# EAGLE design control (EAGLE 9.0.1)
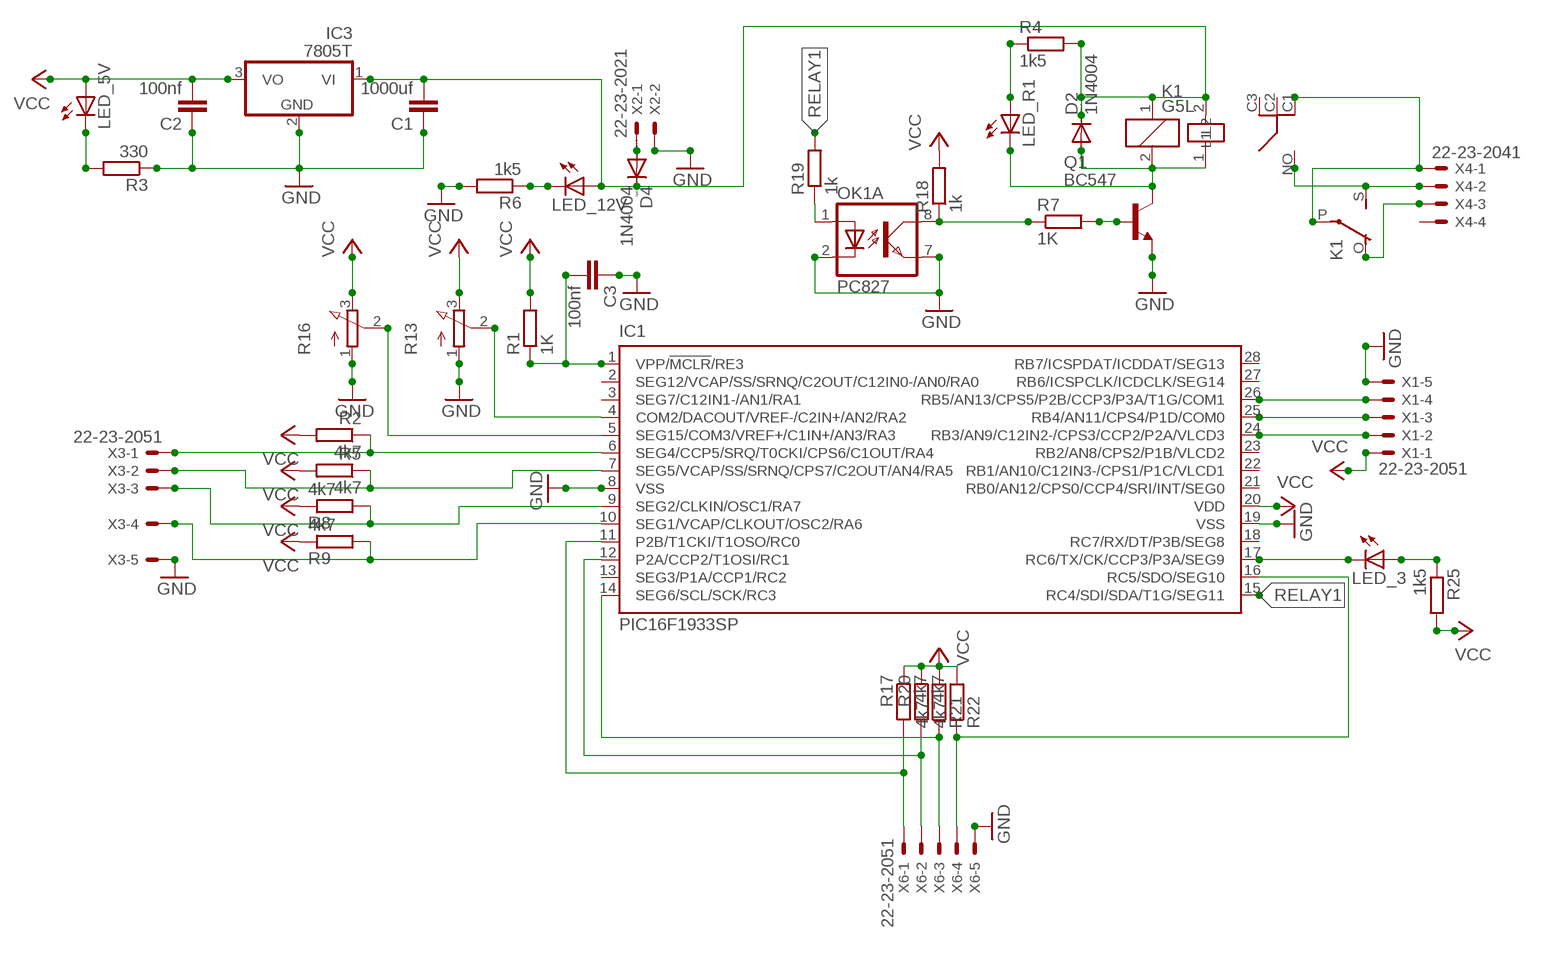
[diagram p0: schematic, sheet 1]

## Parts
C1  1000uf  C5/2.5  [C5B2.5]
C2  100nf  C2.5/6  [C2.5-6]
C3  100nf  C2.5/6  [C2.5-6]
D2  1N4004  [DO41-10]
D4  1N4004  [DO41-10]
IC1  PIC16F1933SP  [DIL28-3]
IC3  7805T  [TO220H]
K1  G5L  [G5LE]
LED_3  LED3MM  [LED3MM]
LED_5V  LED3MM  [LED3MM]
LED_12V  LED3MM  [LED3MM]
LED_R1  LED3MM  [LED3MM]
OK1  PC827  [DIL08]
Q1  BC547  BC548  [TO92-EBC]
R1  1K  R-EU_0207/10  [0207/10]
R2  4k7  R-EU_0207/10  [0207/10]
R3  330  R-EU_0207/10  [0207/10]
R4  1k5  R-EU_0207/10  [0207/10]
R5  4k7  R-EU_0207/10  [0207/10]
R6  1k5  R-EU_0207/10  [0207/10]
R7  1K  R-EU_0207/10  [0207/10]
R8  4k7  R-EU_0207/10  [0207/10]
R9  4k7  R-EU_0207/10  [0207/10]
R13  3RP/1610N  [3RP/1610N]
R16  3RP/1610N  [3RP/1610N]
R17  4k7  R-EU_0207/10  [0207/10]
R18  1k  R-EU_0207/10  [0207/10]
R19  1k  R-EU_0207/10  [0207/10]
R20  4k7  R-EU_0207/10  [0207/10]
R21  4k7  R-EU_0207/10  [0207/10]
R22  4k7  R-EU_0207/10  [0207/10]
R25  1k5  R-EU_0207/10  [0207/10]
U$1  RL703  [RL703]
X1  22-23-2051  [22-23-2051]
X2  22-23-2021  [22-23-2021]
X3  22-23-2051  [22-23-2051]
X4  22-23-2041  [22-23-2041]
X6  22-23-2051  [22-23-2051]

## Nets
GND: C1.1 C2.1 C3.1 IC1.8(VSS) IC1.19(VSS) IC3.2(GND) OK1.2(A:C) OK1.7(A:EMIT) Q1.E R3.1 R6.2 R13.1(A) R16.1(A) X1.5 X2.2 X3.5 X6.5
N$1: IC1.7(SEG5/VCAP/SS/SRNQ/CPS7/C2OUT/AN4/RA5) R5.1 X3.2
N$2: C3.2 IC1.1(VPP/!MCLR!/RE3) R1.1
N$3: IC1.4(COM2/DACOUT/VREF-/C2IN+/AN2/RA2) R13.2(S)
N$4: IC1.5(SEG15/COM3/VREF+/C1IN+/AN3/RA3) R16.2(S)
N$5: IC1.25(RB4/AN11/CPS4/P1D/COM0) X1.3
N$6: IC1.6(SEG4/CCP5/SRQ/T0CKI/CPS6/C1OUT/RA4) R2.1 X3.1
N$7: IC1.9(SEG2/CLKIN/OSC1/RA7) R8.2 X3.3
N$8: IC1.10(SEG1/VCAP/CLKOUT/OSC2/RA6) R9.2 X3.4
N$9: IC1.14(SEG6/SCL/SCK/RC3) R21.1 X6.3
N$10: Q1.B R7.2
N$11: D2.A K1.2 LED_R1.K(C) Q1.C U$1.1(L2)
N$13: IC1.11(P2B/T1CKI/T1OSO/RC0) R17.2 X6.1
N$14: IC1.24(RB3/AN9/C12IN2-/CPS3/CCP2/P2A/VLCD3) X1.2
N$15: IC1.12(P2A/CCP2/T1OSI/RC1) R20.2 X6.2
N$18: K1.S(2:S) U$1.NO X4.2
N$19: K1.P(2:P) U$1.C1 X4.1
N$20: K1.O(2:O) X4.3
N$21: D4.A X2.1
N$22: LED_5V.K(C) R3.2
N$24: IC1.26(RB5/AN13/CPS5/P2B/CCP3/P3A/T1G/COM1) X1.4
N$26: LED_R1.A R4.1
N$30: LED_12V.K(C) R6.1
N$37: C1.2 D2.C D4.C IC3.1(VI) K1.1 LED_12V.A R4.2 U$1.2(L1)
N$38: OK1.8(A:COL) R7.1 R18.1
N$41: OK1.1(A:A) R19.1
N$42: IC1.16(RC5/SDO/SEG10) R22.1 X6.4
N$46: LED_3.A R25.1
N$47: IC1.17(RC6/TX/CK/CCP3/P3A/SEG9) LED_3.K(C)
RELAY1: IC1.15(RC4/SDI/SDA/T1G/SEG11) R19.2
VCC: C2.2 IC1.20(VDD) IC3.3(VO) LED_5V.A R1.2 R2.2 R5.2 R8.1 R9.1 R13.3(E) R16.3(E) R17.1 R18.2 R20.1 R21.2 R22.2 R25.2 X1.1
Unconnected: IC1.2(SEG12/VCAP/SS/SRNQ/C2OUT/C12IN0-/AN0/RA0) IC1.3(SEG7/C12IN1-/AN1/RA1) IC1.13(SEG3/P1A/CCP1/RC2) IC1.18(RC7/RX/DT/P3B/SEG8) IC1.21(RB0/AN12/CPS0/CCP4/SRI/INT/SEG0) IC1.22(RB1/AN10/C12IN3-/CPS1/P1C/VLCD1) IC1.23(RB2/AN8/CPS2/P1B/VLCD2) IC1.27(RB6/ICSPCLK/ICDCLK/SEG14) IC1.28(RB7/ICSPDAT/ICDDAT/SEG13) OK1.3(B:A) OK1.4(B:C) OK1.5(B:EMIT) OK1.6(B:COL) U$1.C2 U$1.C3 X4.4

## Library data of the parts
C1-C3 = capacitor-wima:C: CAPACITOR naming: grid - package width
D2 D4 = diode:1N4004: DIODE general purpose rectifier, 1 A
IC1 = microchip:PIC16F19*: Flash-Based, 8-Bit CMOS Microcontrollers wtih LCD Driver and nanoWatt XLP Technology Auto generated by make-symbol-device-package-bsdl.ulp Rev. 33 Source: http://ww1.microchip.com/downloads/en/DeviceDoc/41364D.pdf; MPN: PIC16F1933-I/SP; OC_FARNELL: 1755814; OC_NEWARK: 08R1938
IC3 = linear:78*: Positive VOLTAGE REGULATOR Source: http://cache.national.com/ds/LM/LM78L05.pdf http://www.fairchildsemi.com/ds/LM/LM7805.pdf
K1 = relay:G5L: RELAY 1 x switch, 10 A/120 V AC, 8 A/30 V ADC, Omron; OC_FARNELL: unknown; OC_NEWARK: unknown
LED_3 LED_5V LED_12V LED_R1 = led:LED: LED OSRAM: - CHIPLED LG R971, LG N971, LY N971, LG Q971, LY Q971, LO R971, LY R971 LH N974, LH R974 LS Q976, LO Q976, LY Q976 LO Q996 - Hyper CHIPLED LW Q18S LB Q993, LB Q99A, LB R99A - SideLED LS A670, LO A670, LY A670, LG A670, LP A670 LB A673, LV A673, LT A673, LW A673 LH A674 LY A675 LS A676, LA A676, LO A676, LY A676, LW A676 LS A679, LY A679, LG A679 - Hyper Micro SIDELED® LS Y876, LA Y876, LO Y876, LY Y876 LT Y87S - SmartLED LW L88C, LW L88S LB L89C, LB L89S, LG L890 LS L89K, LO L89K, LY L89K LS L896, LA L896, LO L896, LY L896 - TOPLED LS T670, LO T670, LY T670, LG T670, LP T670 LSG T670, LSP T670, LSY T670, LOP T670, LYG T670 LG T671, LOG T671, LSG T671 LB T673, LV T673, LT T673, LW T673 LH T674 LS T676, LA T676, LO T676, LY T676, LB T676, LH T676, LSB T676, LW T676 LB T67C, LV T67C, LT T67C, LS T67K, LO T67K, LY T67K, LW E67C LS E67B, LA E67B, LO E67B, LY E67B, LB E67C, LV E67C, LT E67C LW T67C LS T679, LY T679, LG T679 LS T770, LO T770, LY T770, LG T770, LP T770 LB T773, LV T773, LT T773, LW T773 LH T774 LS E675, LA E675, LY E675, LS T675 LS T776, LA T776, LO T776, LY T776, LB T776 LHGB T686 LT T68C, LB T68C - Hyper Mini TOPLED® LB M676 - Mini TOPLED Santana® LG M470 LS M47K, LO M47K, LY M47K Source: http://www.osram.convergy.de LUXEON: - LUMILED® LXK2-PW12-R00, LXK2-PW12-S00, LXK2-PW14-U00, LXK2-PW14-V00 LXK2-PM12-R00, LXK2-PM12-S00, LXK2-PM14-U00 LXK2-PE12-Q00, LXK2-PE12-R00, LXK2-PE12-S00, LXK2-PE14-T00, LXK2-PE14-U00 LXK2-PB12-K00, LXK2-PB12-L00, LXK2-PB12-M00, LXK2-PB14-N00, LXK2-PB14-P00, LXK2-PB14-Q00 LXK2-PR12-L00, LXK2-PR12-M00, LXK2-PR14-Q00, LXK2-PR14-R00 LXK2-PD12-Q00, LXK2-PD12-R00, LXK2-PD12-S00 LXK2-PH12-R00, LXK2-PH12-S00 LXK2-PL12-P00, LXK2-PL12-Q00, LXK2-PL12-R00 Source: www.luxeon.com KINGBRIGHT: KA-3528ASYC Source: www.kingbright.com
OK1 = optocoupler:PC827: SHARP OPTO COUPLER; OC_FARNELL: unknown; OC_NEWARK: unknown
Q1 = transistor-npn:BC548*: NPN Transistor
R1-R9 R17-R22 R25 = resistor:R-EU_: RESISTOR, European symbol
R13 R16 = pot:3RP/1610N: 16mm Potentiometer one level Source: http://www.alphapotentiometers.net/html/16mm_pot_2.html
U$1 = relay:RL703
X1 X3 X6 = con-molex:22-23-2051: .100" (2.54mm) Center Header - 5 Pin; MF: MOLEX; MPN: 22-23-2051; OC_FARNELL: 1462952; OC_NEWARK: 38C9178
X2 = con-molex:22-23-2021: .100" (2.54mm) Center Header - 2 Pin; MF: MOLEX; MPN: 22-23-2021; OC_FARNELL: 1462926; OC_NEWARK: 25C3832
X4 = con-molex:22-23-2041: .100" (2.54mm) Center Header - 4 Pin; MF: MOLEX; MPN: 22-23-2041; OC_FARNELL: 1462920; OC_NEWARK: 38C0355

## Board
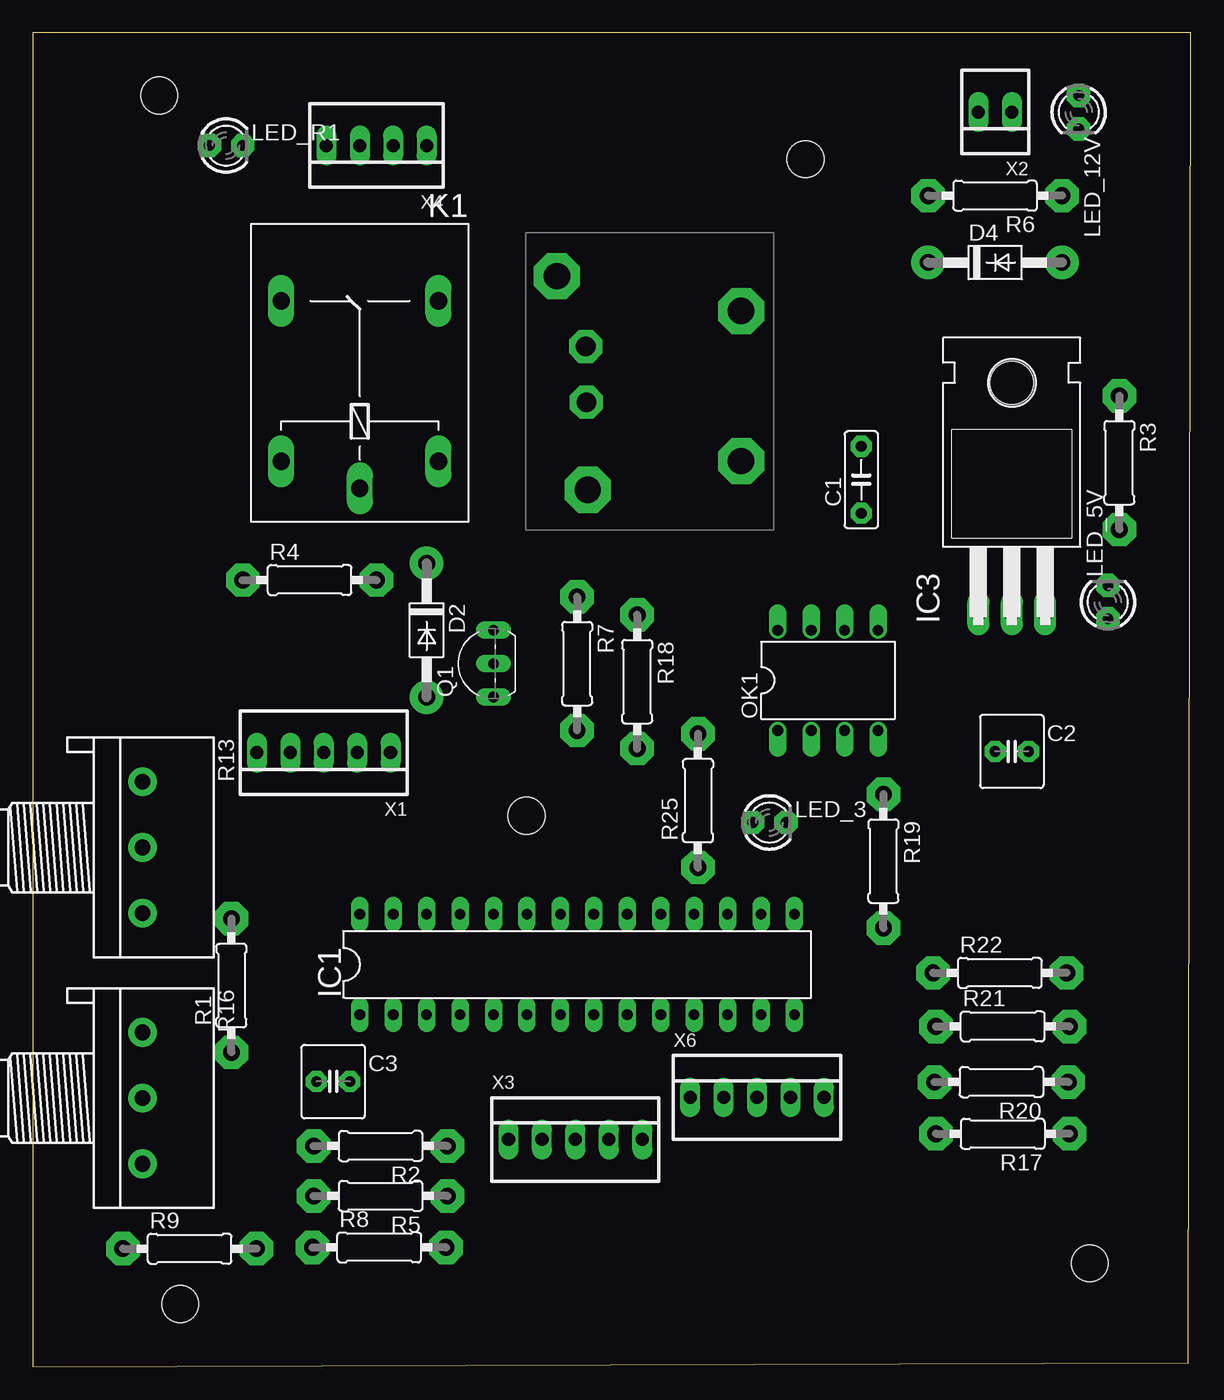
[diagram p1: board, top side]
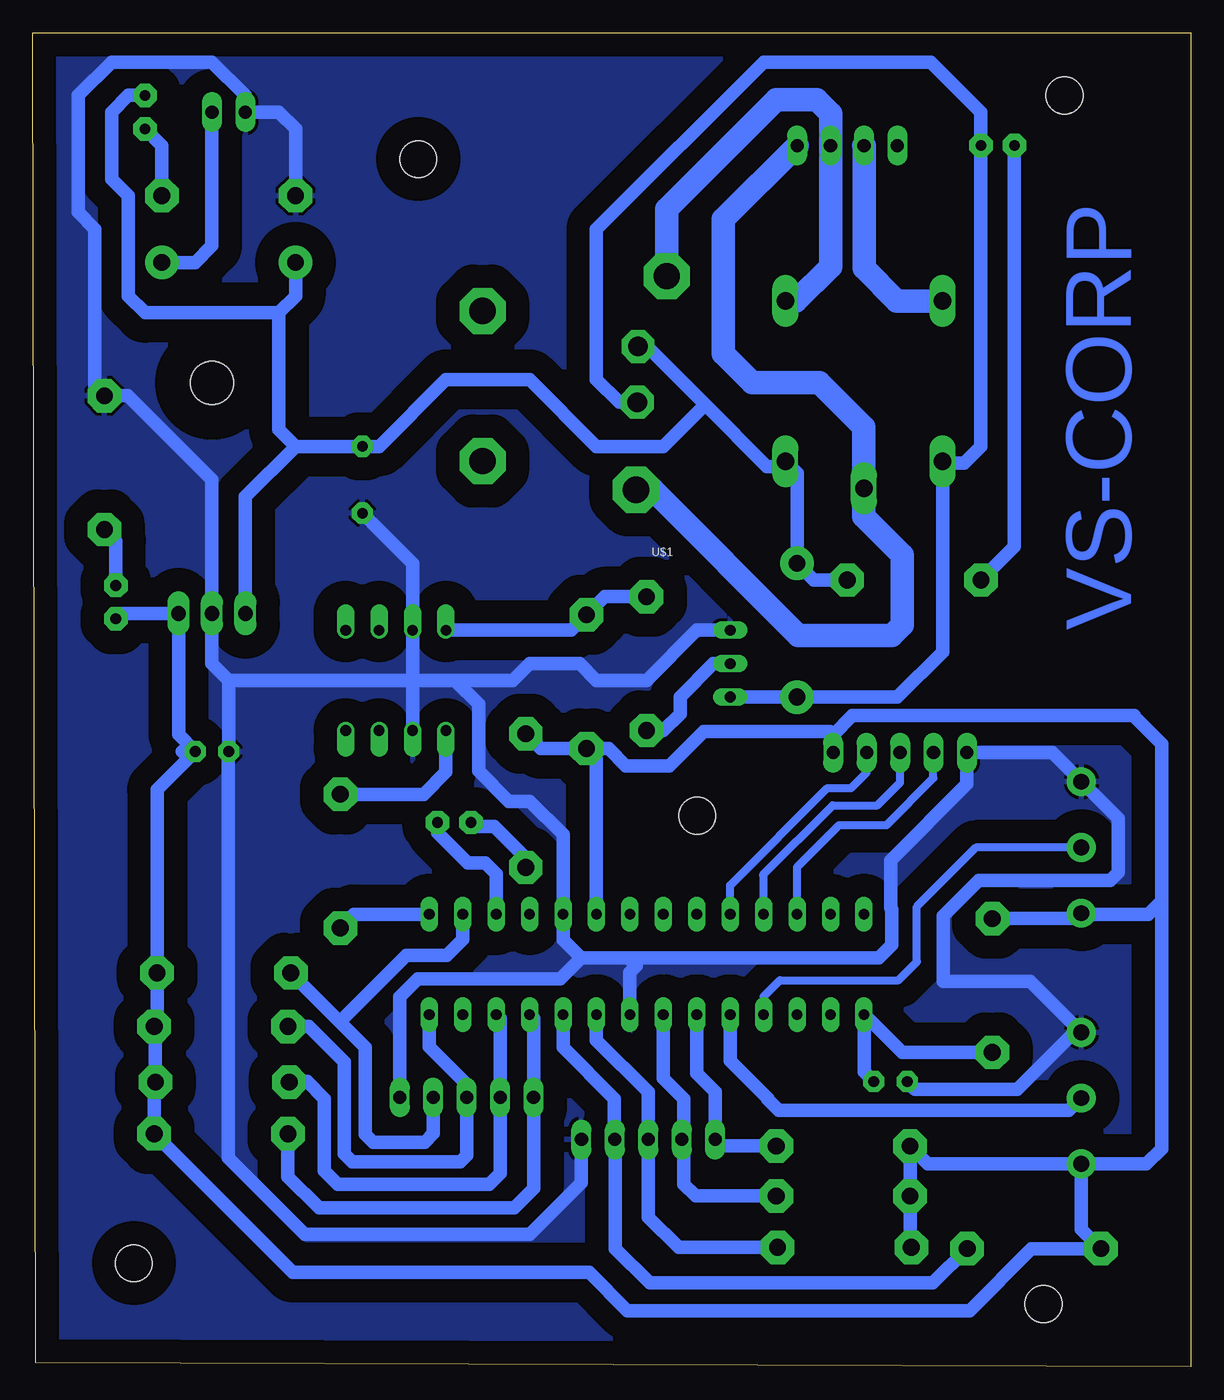
[diagram p2: board, bottom side, seen from below]

Size 87.96 x 101.35 mm. Coordinates in mm from the lower left corner, seen from the top.
Outline: 0,0 87.76,0.3 87.96,101.35 0,101.35 0,0
Copper layers (1*16): Top 0.035mm / dielectric 1.5mm / Bottom 0.035mm
Design rules "default": minimum track width 10mil, minimum drill 24mil, track to track 8mil, track to pad 8mil, pad to pad 8mil, via to via 8mil, smd to smd 8mil, copper to edge 40mil, drill to drill 8mil, minimum pad ring 10mil, minimum via ring 8mil, stop-mask expansion 4mil, vias tented up to drill 0mil, thermal gap 10mil
Holes 2.8 mm at 80.29,7.86 9.59,96.6 11.19,4.76 37.49,41.86 58.69,91.76

### Footprints (pad centres in the part's own frame; a part is rotated, then mirrored left to right if it is on the bottom)
C5B2.5 = drill 0.813 pad 1.6 octagon: 1 -2.54,0; 2 2.54,0
C2.5-6 = drill 0.813 pad 1.6 octagon: 1 -1.27,0; 2 1.27,0
DO41-10 = drill 1.27 pad 2.54: A 5.08,0; C -5.08,0
DIL28-3 = drill 0.813 long: 1 -16.51,-3.81; 2 -13.97,-3.81; 3 -11.43,-3.81; 4 -8.89,-3.81; 5 -6.35,-3.81; 6 -3.81,-3.81; 7 -1.27,-3.81; 8 1.27,-3.81; 9 3.81,-3.81; 10 6.35,-3.81; 11 8.89,-3.81; 12 11.43,-3.81; 13 13.97,-3.81; 14 16.51,-3.81; 15 16.51,3.81; 16 13.97,3.81; 17 11.43,3.81; 18 8.89,3.81; 19 6.35,3.81; 20 3.81,3.81; 21 1.27,3.81; 22 -1.27,3.81; 23 -3.81,3.81; 24 -6.35,3.81; 25 -8.89,3.81; 26 -11.43,3.81; 27 -13.97,3.81; 28 -16.51,3.81
TO220H = drill 1.118 long: 1 -2.54,-10.16; 2 0,-10.16; 3 2.54,-10.16 | hole 3.302: 0,7.366
G5LE = drill 1.321 long: 1 -7.493,-5.969; 2 -7.493,5.969; O 4.699,5.969; P -9.525,0; S 4.699,-5.969
LED3MM = drill 0.813 pad 1.778 octagon: A -1.27,0; K 1.27,0
DIL08 = drill 0.813 offset: 1 -3.81,-3.81; 2 -1.27,-3.81; 3 1.27,-3.81; 4 3.81,-3.81; 5 3.81,3.81; 6 1.27,3.81; 7 -1.27,3.81; 8 -3.81,3.81
TO92-EBC = drill 0.813 long: B 0,-1.27; C -2.54,-1.27; E 2.54,-1.27
0207/10 = drill 1.27 pad 2.54 octagon: 1 -5.08,0; 2 5.08,0
3RP/1610N = drill 1.2 pad 2.184: 1 -5,0; 2 0,0; 3 5,0
RL703 = drill 1.5 pad 2.5 octagon: 1 1.73,-5.643; 2 -2.51,-5.693 | drill 2 pad 3.5 octagon: C1 8.38,-5.543; C2 6.2,6.107; C3 -5.21,6.107; NO -7.86,-7.883
22-23-2051 = drill 1 long: 1 -5.08,0; 2 -2.54,0; 3 0,0; 4 2.54,0; 5 5.08,0
22-23-2021 = drill 1 long: 1 -1.27,0; 2 1.27,0
22-23-2041 = drill 1 long: 1 -3.81,0; 2 -1.27,0; 3 1.27,0; 4 3.81,0

### Placement (x,y rotation side)
C1  62.93,67.39 90 top
C2  74.36,46.75 0 top
C3  22.81,21.66 0 top
D2  29.91,55.96 270 top
D4  73.09,83.9 0 top
IC1  41.34,30.56 0 top
IC3  74.36,67.39 0 top
K1  24.83,76.28 90 top
LED_3  55.95,41.35 0 top
LED_5V  81.66,58.09 90 top
LED_12V  79.44,95.33 270 top
LED_R1  14.67,92.79 0 top
OK1  60.39,52.15 0 top
Q1  33.72,53.42 90 top
R1  15.08,28.96 90 top
R2  26.41,16.76 180 top
R3  82.53,68.69 270 top
R4  21.02,59.77 0 top
R5  26.41,12.96 180 top
R6  73.09,88.98 180 top
R7  41.34,53.42 270 top
R8  26.31,9.06 0 top
R9  11.91,8.96 0 top
R13  8.32,39.45 270 top
R16  8.32,20.4 270 top
R17  73.67,17.69 180 top
R18  45.9,52.05 270 top
R19  64.61,38.41 270 top
R20  73.57,21.62 180 top
R21  73.67,25.85 0 top
R22  73.45,29.92 0 top
R25  50.52,43.01 90 top
U$1  47.69,75.01 270 top
X1  22.09,46.66 180 top
X2  73.09,95.33 180 top
X3  41.21,17.26 0 top
X4  26.1,92.79 180 top
X6  55.01,20.46 0 top

### Tracks (layer width: path | path; a pad name or v marks a point on that pad's centre or on a via)
GND
  Bottom 1.016: R6.2 68.01,94.06 69.28,95.33 X2.2 71.82,96.6 74.36,99.14 81.98,99.14 84.52,96.6 84.52,87.71 83.25,86.44 83.25,74.49 R3.1 80.74,73.77 74.36,67.39 IC3.2 74.36,53.42 73.09,52.15 | 59.12,52.15 OK1.7 59.12,61.04 C1.1 | 59.12,52.15 OK1.2 | 55.91,52.15 51.5,52.15 50.23,53.42 46.42,53.42 45.15,52.15 41.34,52.15 37.53,55.96 Q1.E | 55.91,52.15 59.12,52.15 | 59.12,52.15 73.09,52.15 | 42.61,31.06 23.71,31.06 22.71,32.06 22.71,34.76 22.81,34.86 22.81,38.46 17.01,44.26 X1.5 10.53,46.66 R13.1 5.51,41.64 5.51,37.56 6.11,36.96 16.11,36.96 18.81,34.26 18.81,29.26 12.18,29.26 R16.1 8.58,25.66 13.18,21.06 20.94,21.06 C3.1 21.04,21.16 | 42.61,31.06 46.31,31.06 | 46.31,31.06 47.69,32.44 IC1.19 47.69,40.44 50.21,42.96 51.81,42.96 54.11,45.26 54.11,50.35 55.91,52.15 | 73.09,52.15 C2.1 73.11,46.73 73.11,15.86 67.31,10.06 50.21,10.06 46.29,13.98 X3.5 | IC1.8 42.61,29.96 42.11,30.46 42.61,30.96 42.61,31.06 | X6.5 60.09,28.08 58.71,29.46 47.91,29.46 46.31,31.06
  pour Bottom (isolate 1.778): -0.07,101.98 87.95,101.48 87.75,0.1 -0.27,0.6
N$1
  Bottom 1.016: IC1.7 40.07,21.92 38.51,20.36 38.51,17.42 | 38.51,17.42 X3.2 | R5.1 37.61,12.96 38.51,13.86 38.51,17.42
N$2
  Bottom 1.016: IC1.1 | C3.2 24.82,22.4 IC1.1 | R1.1 21.94,23.88 IC1.1
N$3
  Bottom 0.61: IC1.4 32.45,28.12 31.21,29.36 22.21,29.36 20.81,30.76 20.81,34.96 16.32,39.45 R13.2 8.32,39.05
N$4
  Bottom 1.016: IC1.5 34.99,23.24 32.15,20.4 32.15,20.3 31.31,19.46 9.26,19.46 R16.2
N$5
  Bottom 0.61: IC1.25 32.45,37.3 32.51,37.36 27.21,42.66 23.81,42.66 22.09,44.38 X1.3
N$6
  Bottom 1.016: IC1.6 37.53,22.28 36.13,20.88 X3.1 35.63,16.76 R2.1
N$7
  Bottom 1.016: IC1.9 45.15,24.8 41.21,20.86 X3.3 41.21,11.36 38.91,9.06 R8.2
N$8
  Bottom 1.016: IC1.10 47.69,24.24 43.81,20.36 43.81,17.32 | 43.81,17.32 X3.4 | 43.81,17.32 43.93,17.2 43.71,16.98 43.71,8.96 41.11,6.36 19.59,6.36 R9.2
N$9
  Bottom 1.016: IC1.14 57.85,24.3 55.01,21.46 X6.3 55.01,16.06 55.51,15.56 63.71,15.56 64.31,16.16 64.31,23.16 67,25.85 R21.1
N$10
  Bottom 1.016: Q1.B 36.26,53.42 38.8,50.88 38.8,49.61 40.07,48.34 R7.2
N$11
  Bottom 1.016: U$1.1 43.42,73.28 45.15,75.01 45.15,86.44 32.45,99.14 19.75,99.14 15.94,95.33 LED_R1.K 15.94,69.93 17.21,68.66 18.73,68.66 K1.2 18.86,54.31 22.29,50.88 D2.A Q1.C
N$13
  Bottom 1.016: IC1.11 49.93,26.45 X6.1 49.93,13.54 51.41,12.06 66.21,12.06 68.59,14.44 R17.2
N$14
  Bottom 0.61: IC1.24 34.99,36.58 27.61,43.96 25.81,43.96 24.63,45.14 X1.2
N$15
  Bottom 1.016: R20.2 67.15,21.62 67.11,21.66 65.81,20.36 65.81,14.86 64.81,13.86 53.31,13.86 52.47,14.7 X6.2 52.47,26.45 IC1.12
N$18
  Bottom 1.8: K1.S 30.03,80.98 30.01,80.96 27.37,83.6 X4.2 27.37,95.22 28.41,96.26 31.51,96.26 39.81,87.96 U$1.NO
N$19
  Bottom 1.8: X4.1 35.51,87.19 35.51,76.96 33.31,74.76 28.21,74.76 24.83,71.38 K1.P 24.83,64.58 21.91,61.66 21.91,56.36 22.71,55.56 29.81,55.56 40.88,66.63 U$1.C1
N$20
  Bottom 1.8: X4.3 24.81,92.77 24.81,83.46 22.33,80.98 K1.O
N$21
  Bottom 1.016: X2.1 74.36,85.17 75.63,83.9 D4.A
N$22
  Bottom 1.016: LED_5V.K 81.66,62.74 R3.2
N$24
  Bottom 0.61: IC1.26 29.91,37.96 26.71,41.16 23.11,41.16 19.55,44.72 X1.4
N$26
  Bottom 1.016: LED_R1.A 13.4,62.31 R4.1
N$30
  Bottom 1.016: LED_12V.K 78.17,92.79 R6.1
N$37
  Bottom 1.016: D4.C 68.01,81.36 69.28,80.09 | 69.28,80.09 79.44,80.09 80.71,81.36 80.71,88.98 81.98,90.25 81.98,95.33 80.71,96.6 LED_12V.A | IC3.1 71.82,66.12 68.01,69.93 | 68.01,69.93 C1.2 61.66,69.93 56.58,75.01 50.23,75.01 45.15,69.93 40.07,69.93 36.89,73.1 | 69.28,80.09 69.28,71.2 68.01,69.93 | 36.89,73.1 32.2,68.41 31.18,68.41 K1.1 29.91,67.9 D2.C 28.64,59.77 R4.2 | 36.89,73.1 41.34,77.55 41.97,77.55 U$1.2
N$38
  Bottom 1.016: OK1.8 47.07,55.96 R18.1 44.53,58.5 R7.1
N$41
  Bottom 1.016: OK1.1 56.58,45.19 58.28,43.49 R19.1
N$42
  Bottom 1.016: X6.4 57.55,17.72 58.21,17.06 62.11,17.06 62.71,17.66 62.71,24.26 64.66,26.21 | 64.66,26.21 R22.1 | IC1.16 55.31,32.46 56.51,31.26 59.61,31.26 64.66,26.21
N$46
  Bottom 1.016: LED_3.A 54.39,41.06 52.91,41.06 50.52,38.67 R25.1
N$47
  Bottom 1.016: LED_3.K 57.22,40.57 54.91,38.26 53.61,38.26 52.77,37.42 IC1.17
RELAY1
  Bottom 1.016: R19.2 63.57,34.37 IC1.15
VCC
  Bottom 1.016: 2.22,35.39 2.22,47.32 4.31,49.41 4.31,49.46 25.71,49.46 27.17,48 | 2.22,35.39 3.24,34.37 8.24,34.37 | 8.24,34.37 R13.3 | R18.2 45.15,46.22 IC1.20 | R25.2 49.4,46.97 R18.2 | R16.3 3.37,15.4 2.22,16.55 2.22,35.39 | 27.17,48 X1.1 | R18.2 44.22,46.97 42.91,45.66 39.61,45.66 37.01,48.26 27.43,48.26 27.17,48 | LED_5V.A 81.25,57.23 IC3.3 76.9,48.02 C2.2 | C2.2 76.62,46.75 | 79.11,17.36 78.78,17.69 R17.1 | R17.1 78.75,21.52 R20.1 78.65,25.75 | 78.65,25.75 R21.2 | 78.65,25.75 78.53,25.87 R22.2 78.53,43.85 C2.2 | R16.3 19.97,15.4 R2.2 R5.2 21.33,9.16 R8.1 21.23,8.48 21.01,8.26 | R16.3 8.32,10.45 R9.1 12.11,8.96 16.81,4.26 42.81,4.26 45.71,7.16 68.22,7.16 R17.1 | R1.2 8.57,34.04 8.24,34.37

### Text on the board
Bottom: VS-CORP